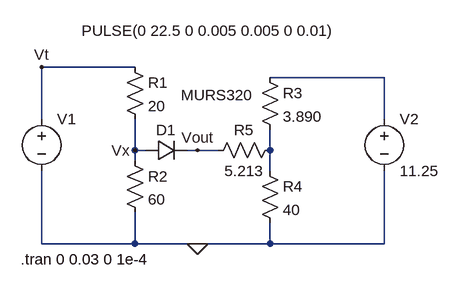
[diagram p0: schematic questao3.asc]
questao3.asc, the LTspice schematic file:
Version 4
SHEET 1 880 680
WIRE 160 48 16 48
WIRE 544 64 368 64
WIRE 16 128 16 48
WIRE 544 128 544 64
WIRE 160 176 160 128
WIRE 176 176 160 176
WIRE 256 176 240 176
WIRE 288 176 256 176
WIRE 368 176 368 144
WIRE 160 192 160 176
WIRE 368 208 368 176
WIRE 16 320 16 208
WIRE 160 320 160 272
WIRE 160 320 16 320
WIRE 256 320 160 320
WIRE 368 320 368 288
WIRE 368 320 256 320
WIRE 544 320 544 208
WIRE 544 320 368 320
FLAG 256 320 0
FLAG 256 176 Vout
FLAG 160 176 Vx
FLAG 16 48 Vt
SYMBOL voltage 16 112 R0
WINDOW 3 62 -120 Left 2
WINDOW 123 0 0 Left 0
WINDOW 39 0 0 Left 0
SYMATTR Value PULSE(0 22.5 0 0.005 0.005 0 0.01)
SYMATTR InstName V1
SYMBOL voltage 544 112 R0
WINDOW 123 0 0 Left 0
WINDOW 39 0 0 Left 0
SYMATTR InstName V2
SYMATTR Value 11.25
SYMBOL res 144 32 R0
SYMATTR InstName R1
SYMATTR Value 20
SYMBOL res 144 176 R0
SYMATTR InstName R2
SYMATTR Value 60
SYMBOL diode 176 192 R270
WINDOW 0 32 32 VTop 2
WINDOW 3 117 110 VBottom 2
SYMATTR InstName D1
SYMATTR Value MURS320
SYMBOL res 272 192 R270
WINDOW 0 32 56 VTop 2
WINDOW 3 0 56 VBottom 2
SYMATTR InstName R5
SYMATTR Value 5.213
SYMBOL res 352 48 R0
SYMATTR InstName R3
SYMATTR Value 3.890
SYMBOL res 352 192 R0
SYMATTR InstName R4
SYMATTR Value 40
TEXT -16 344 Left 2 !.tran 0 0.03 0 1e-4

The netlist it stands for:
* questao3.asc
V1 Vt 0 PULSE(0 22.5 0 0.005 0.005 0 0.01)
V2 N001 0 11.25
R1 Vt Vx 20
R2 Vx 0 60
D1 Vx Vout MURS320
R5 Vout N002 5.213
R3 N001 N002 3.890
R4 N002 0 40
.model D D
.lib standard.dio
.tran 0 0.03 0 1e-4
.backanno
.end